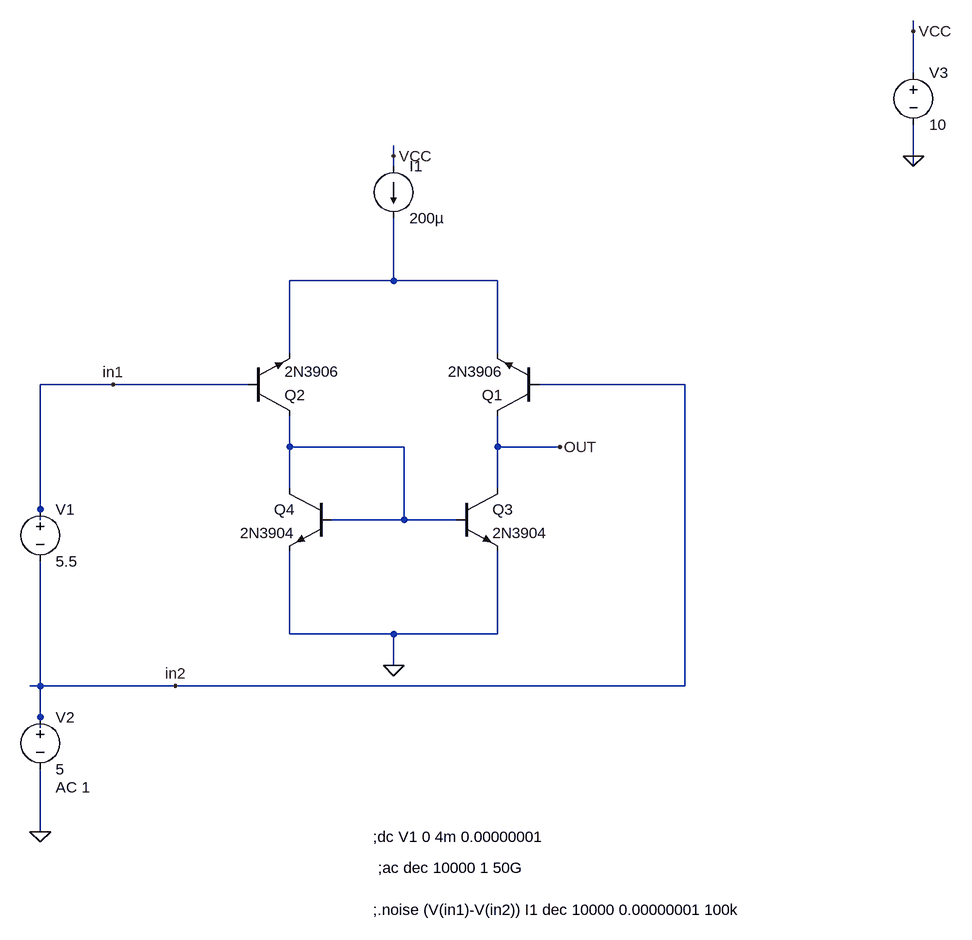
[diagram p0: schematic ask2_3.asc]
ask2_3.asc, the LTspice schematic file:
Version 4
SHEET 1 1032 872
WIRE 976 -496 976 -512
WIRE 976 -432 976 -496
WIRE 176 -304 176 -320
WIRE 976 -304 976 -352
WIRE 176 -288 176 -304
WIRE 976 -288 976 -304
WIRE 176 -112 176 -208
WIRE 176 -112 16 -112
WIRE 336 -112 176 -112
WIRE 16 0 16 -112
WIRE 336 0 336 -112
WIRE -256 48 -368 48
WIRE -48 48 -256 48
WIRE 624 48 400 48
WIRE 16 144 16 96
WIRE 192 144 16 144
WIRE 336 144 336 96
WIRE 432 144 336 144
WIRE 16 208 16 144
WIRE 336 208 336 144
WIRE -368 240 -368 48
WIRE -368 256 -368 240
WIRE 192 256 192 144
WIRE 192 256 80 256
WIRE 272 256 192 256
WIRE 16 432 16 304
WIRE 176 432 16 432
WIRE 336 432 336 304
WIRE 336 432 176 432
WIRE 176 480 176 432
WIRE -368 512 -368 320
WIRE -368 512 -384 512
WIRE -160 512 -368 512
WIRE 624 512 624 48
WIRE 624 512 -160 512
WIRE -368 560 -368 512
WIRE -368 576 -368 560
WIRE -368 736 -368 640
FLAG 176 480 0
FLAG 176 -304 VCC
FLAG -368 736 0
FLAG 976 -304 0
FLAG 976 -496 VCC
FLAG 432 144 OUT
FLAG -256 48 in1
FLAG -160 512 in2
SYMBOL npn 272 208 R0
SYMATTR InstName Q3
SYMATTR Value 2N3904
SYMBOL npn 400 96 R180
SYMATTR InstName Q1
SYMATTR Value 2N3906
SYMBOL npn 80 208 M0
SYMATTR InstName Q4
SYMATTR Value 2N3904
SYMBOL npn -48 96 M180
SYMATTR InstName Q2
SYMATTR Value 2N3906
SYMBOL current 176 -288 R0
SYMATTR InstName I1
SYMATTR Value 200µ
SYMBOL voltage -368 224 R0
SYMATTR InstName V1
SYMATTR Value 5.5
SYMBOL voltage -368 544 R0
WINDOW 123 24 124 Left 2
WINDOW 39 0 0 Left 0
SYMATTR InstName V2
SYMATTR Value 5
SYMATTR Value2 AC 1
SYMBOL voltage 976 -448 R0
SYMATTR InstName V3
SYMATTR Value 10
TEXT 144 744 Left 2 !;dc V1 0 4m 0.00000001
TEXT 152 792 Left 2 !;ac dec 10000 1 50G
TEXT 144 856 Left 2 !;.noise (V(in1)-V(in2)) I1 dec 10000 0.00000001 100k

The netlist it stands for:
* ask2_3.asc
Q3 OUT N002 0 0 2N3904
Q1 OUT in2 N001 0 2N3906
Q4 N002 N002 0 0 2N3904
Q2 N002 in1 N001 0 2N3906
I1 VCC N001 200µ
V1 in1 in2 5.5
V2 in2 0 5 AC 1
V3 VCC 0 10
.model NPN NPN
.model PNP PNP
.lib standard.bjt
;dc V1 0 4m 0.00000001
;ac dec 10000 1 50G
;.noise (V(in1)-V(in2)) I1 dec 10000 0.00000001 100k
.backanno
.end